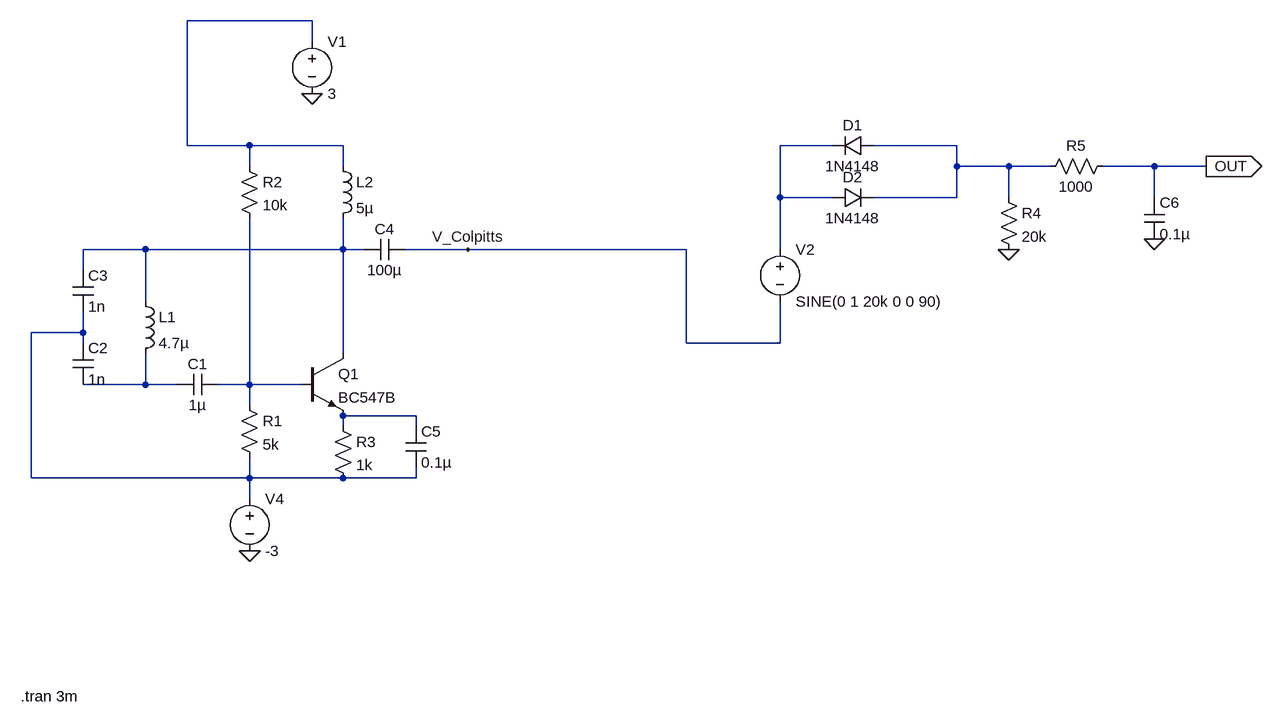
[diagram p0: schematic colpitts_final_final_final.asc]
colpitts_final_final_final.asc, the LTspice schematic file:
Version 4
SHEET 1 2388 680
WIRE 192 -400 0 -400
WIRE 192 -368 192 -400
WIRE 0 -208 0 -400
WIRE 96 -208 0 -208
WIRE 240 -208 96 -208
WIRE 992 -208 912 -208
WIRE 1184 -208 1056 -208
WIRE 96 -176 96 -208
WIRE 240 -176 240 -208
WIRE 1184 -176 1184 -208
WIRE 1264 -176 1184 -176
WIRE 1328 -176 1264 -176
WIRE 1488 -176 1408 -176
WIRE 1568 -176 1488 -176
WIRE 912 -128 912 -208
WIRE 992 -128 912 -128
WIRE 1184 -128 1184 -176
WIRE 1184 -128 1056 -128
WIRE 1264 -128 1264 -176
WIRE 1488 -128 1488 -176
WIRE -64 -48 -160 -48
WIRE 240 -48 240 -96
WIRE 240 -48 -64 -48
WIRE 272 -48 240 -48
WIRE 432 -48 336 -48
WIRE 768 -48 432 -48
WIRE 912 -48 912 -128
WIRE -160 -16 -160 -48
WIRE -64 32 -64 -48
WIRE -160 80 -160 48
WIRE -160 80 -240 80
WIRE -160 96 -160 80
WIRE 768 96 768 -48
WIRE 912 96 912 32
WIRE 912 96 768 96
WIRE 240 112 240 -48
WIRE -64 160 -64 112
WIRE -64 160 -160 160
WIRE -16 160 -64 160
WIRE 96 160 96 -96
WIRE 96 160 48 160
WIRE 176 160 96 160
WIRE 96 192 96 160
WIRE 352 208 240 208
WIRE 240 224 240 208
WIRE 352 224 352 208
WIRE -240 304 -240 80
WIRE 96 304 96 272
WIRE 96 304 -240 304
WIRE 240 304 96 304
WIRE 352 304 352 288
WIRE 352 304 240 304
WIRE 96 336 96 304
FLAG 192 -288 0
FLAG 96 416 0
FLAG 1264 -48 0
FLAG 1488 -64 0
FLAG 1568 -176 OUT
IOPIN 1568 -176 Out
FLAG 432 -48 V_Colpitts
SYMBOL npn 176 112 R0
SYMATTR InstName Q1
SYMATTR Value BC547B
SYMBOL res 80 176 R0
SYMATTR InstName R1
SYMATTR Value 5k
SYMBOL cap 48 144 R90
WINDOW 0 0 32 VBottom 2
WINDOW 3 32 32 VTop 2
SYMATTR InstName C1
SYMATTR Value 1µ
SYMBOL cap -176 96 R0
SYMATTR InstName C2
SYMATTR Value 1n
SYMBOL cap -176 -16 R0
SYMATTR InstName C3
SYMATTR Value 1n
SYMBOL ind -80 16 R0
SYMATTR InstName L1
SYMATTR Value 4.7µ
SYMBOL res 80 -192 R0
SYMATTR InstName R2
SYMATTR Value 10k
SYMBOL ind 224 -192 R0
SYMATTR InstName L2
SYMATTR Value 5µ
SYMBOL cap 336 -64 R90
WINDOW 0 0 32 VBottom 2
WINDOW 3 32 32 VTop 2
SYMATTR InstName C4
SYMATTR Value 100µ
SYMBOL voltage 192 -384 R0
WINDOW 123 0 0 Left 0
WINDOW 39 0 0 Left 0
SYMATTR InstName V1
SYMATTR Value 3
SYMBOL res 224 208 R0
SYMATTR InstName R3
SYMATTR Value 1k
SYMBOL cap 336 224 R0
SYMATTR InstName C5
SYMATTR Value 0.1µ
SYMBOL voltage 96 320 R0
WINDOW 123 0 0 Left 0
WINDOW 39 0 0 Left 0
SYMATTR InstName V4
SYMATTR Value -3
SYMBOL diode 1056 -224 R90
WINDOW 0 0 32 VBottom 2
WINDOW 3 32 32 VTop 2
SYMATTR InstName D1
SYMATTR Value 1N4148
SYMBOL diode 992 -112 R270
WINDOW 0 32 32 VTop 2
WINDOW 3 0 32 VBottom 2
SYMATTR InstName D2
SYMATTR Value 1N4148
SYMBOL res 1248 -144 R0
SYMATTR InstName R4
SYMATTR Value 20k
SYMBOL voltage 912 -64 R0
WINDOW 123 0 0 Left 0
WINDOW 39 0 0 Left 0
SYMATTR InstName V2
SYMATTR Value SINE(0 1 20k 0 0 90)
SYMBOL res 1424 -192 R90
WINDOW 0 0 56 VBottom 2
WINDOW 3 32 56 VTop 2
SYMATTR InstName R5
SYMATTR Value 1000
SYMBOL cap 1472 -128 R0
SYMATTR InstName C6
SYMATTR Value 0.1µ
TEXT -256 640 Left 2 !.tran 3m

The netlist it stands for:
* colpitts_final_final_final.asc
Q1 N004 N007 N008 0 BC547B
R1 N007 N005 5k
C1 N007 N006 1µ
C2 N005 N006 1n
C3 N004 N005 1n
L1 N004 N006 4.7µ
R2 N001 N007 10k
L2 N001 N004 5µ
C4 V_Colpitts N004 100µ
V1 N001 0 3
R3 N008 N005 1k
C5 N008 N005 0.1µ
V4 N005 0 -3
D1 N003 N002 1N4148
D2 N002 N003 1N4148
R4 N003 0 20k
V2 N002 V_Colpitts SINE(0 1 20k 0 0 90)
R5 OUT N003 1000
C6 OUT 0 0.1µ
.model D D
.lib standard.dio
.model NPN NPN
.model PNP PNP
.lib standard.bjt
.tran 3m
.backanno
.end